# Altium schematic sheet LPCB223 - CORE INTERFACE.SchDoc
size A3; Address1: Factory 10; Address2: 9-13 Dingley Avenue, Dandeong, VICTORIA 3175, AUSTRALIA; DocumentNumber: 6; Revision: 1; SheetNumber: 6; SheetTotal: 6; Lockie__PCB_SUB_ASSEMBLY: Core Interface; Lockie__PCB_ASSEMBLY: Main; Lockie__LDL: LPCB223; Lockie__PCB_DESCRIPTION: Power Node
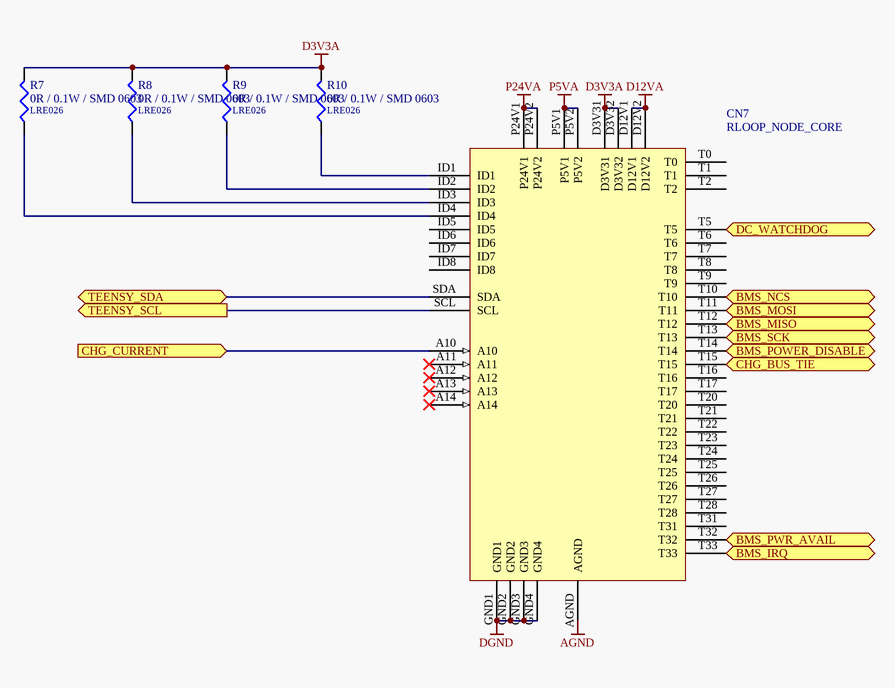
[diagram p0: LPCB223 - CORE INTERFACE.SchDoc]

## Parts
CN7  RLOOP_NODE_CORE  [RLOOP_NODE_CORE]  (no BOM)
R7  0R / 0.1W / SMD 0603  LDL_NUMBER: LRE026  [LFP020__CR1608-0603-IPC7351_B]
R8  0R / 0.1W / SMD 0603  LDL_NUMBER: LRE026  [LFP020__CR1608-0603-IPC7351_B]
R9  0R / 0.1W / SMD 0603  LDL_NUMBER: LRE026  [LFP020__CR1608-0603-IPC7351_B]
R10  0R / 0.1W / SMD 0603  LDL_NUMBER: LRE026  [LFP020__CR1608-0603-IPC7351_B]

## Ports
BMS_IRQ (in), BMS_MISO (in), BMS_MOSI (out), BMS_NCS (out), BMS_POWER_DISABLE (out), BMS_PWR_AVAIL (in), BMS_SCK (out), CHG_BUS_TIE (out), CHG_CURRENT (in), DC_WATCHDOG (out), TEENSY_SCL (out), TEENSY_SDA (bidir)

## Nets
AGND: CN7.AGND
D3V3A: CN7.D3V31 CN7.D3V32 R7.2 R8.2 R9.2 R10.2
D12VA: CN7.D12V1 CN7.D12V2
DGND: CN7.GND1 CN7.GND2 CN7.GND3 CN7.GND4
P5VA: CN7.P5V1 CN7.P5V2
P24VA: CN7.P24V1 CN7.P24V2
BMS_IRQ: CN7.T33 ; port BMS_IRQ
BMS_MISO: CN7.T12 ; port BMS_MISO
BMS_MOSI: CN7.T11 ; port BMS_MOSI
BMS_NCS: CN7.T10 ; port BMS_NCS
BMS_POWER_DISABLE: CN7.T14 ; port BMS_POWER_DISABLE
BMS_PWR_AVAIL: CN7.T32 ; port BMS_PWR_AVAIL
BMS_SCK: CN7.T13 ; port BMS_SCK
CHG_BUS_TIE: CN7.T15 ; port CHG_BUS_TIE
CHG_CURRENT: CN7.A10 ; port CHG_CURRENT
DC_WATCHDOG: CN7.T5 ; port DC_WATCHDOG
TEENSY_SCL: CN7.SCL ; port TEENSY_SCL
TEENSY_SDA: CN7.SDA ; port TEENSY_SDA
NetCN7_ID1: CN7.ID1 R10.1
NetCN7_ID2: CN7.ID2 R9.1
NetCN7_ID3: CN7.ID3 R8.1
NetCN7_ID4: CN7.ID4 R7.1

Not connected (* = marked no-connect by the designer): CN7 A11* A12* A13* A14* ID5 ID6 ID7 ID8 T0 T1 T2 T6 T7 T8 T9 T16 T17 T20 T21 T22 T23 T24 T25 T26 T27 T28 T31

## Notes on the sheet
- PCB COMPONENT DESCRIPTION
- LDL NUMBER
- Assembly Details
- Size
- Drawing File Name
- Revision
- http://rloop.org
- Scale
- A3
- Sheet Details
- N.T.S
- Sheet:
- Of:

## Library data of the parts
CN7 = RLOOP_NODE_CORE: rLoop Node Core Connector; FMEDA__CHANNEL: COM; FMEDA__OPERATING__CURRENT_MAX: 0; FMEDA__OPERATING__TEMP_MAX: 50; FMEDA__OPERATING__TEMP_MIN: -20; FMEDA__OPERATING__TEMP_TYP: 27; FMEDA__OPERATING__VOLTAGE_MAX: 16; FMEDA__OPERATING__VOLTAGE_TYP: 12; FMEDA__OPERATING__CURRENT_MIN: 0; FMEDA__OPERATING__CURRENT_TYP: 0; FMEDA__OPERATING__VOLTAGE_MIN: 0
R7-R10 = 0R / 0.1W / SMD 0603: Resistor, Ceramic Chip, 0R, 0.1W, SMD 0603 [LRE026]; Value: 0; FMEDA__OPERATING__TEMP_MAX: 50; FMEDA__OPERATING__TEMP_MIN: -20; FMEDA__OPERATING__TEMP_TYP: 27; FMEDA__CHANNEL: COM; FMEDA__OPERATING__POWER_MAX: 0; FMEDA__OPERATING__POWER_MIN: 0; FMEDA__OPERATING__VOLTAGE_MAX: 0; FMEDA__OPERATING__VOLTAGE_MIN: 0; FMEDA__OPERATING__VOLTAGE_TYP: 0; FMEDA__FUNCTION_IN_SYSTEM: *